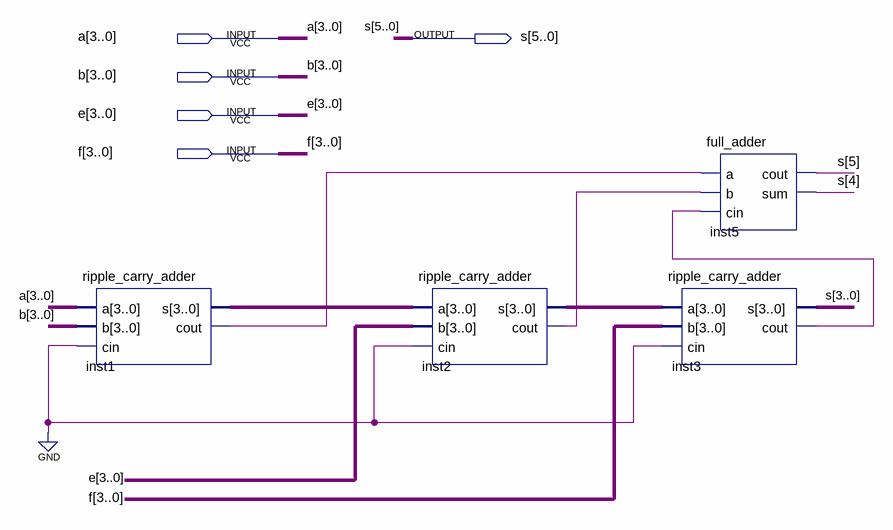
[diagram p0: schematic sheet]
// Quartus schematic ripplecarryadder_4bit_4numbers.bdf as structural Verilog: 4 symbols, 5 pins
module ripplecarryadder_4bit_4numbers (
  input  [3:0] a,
  input  [3:0] b,
  input  [3:0] e,
  input  [3:0] f,
  output [5:0] s
);

  wire inst1_cout, inst2_cout, inst3_cout;
  wire [3:0] inst1_s, inst2_s;

  ripple_carry_adder inst1 (.a(a), .b(b), .cin(1'b0), .s(inst1_s), .cout(inst1_cout));
  ripple_carry_adder inst2 (.a(inst1_s), .b(e), .cin(1'b0), .s(inst2_s), .cout(inst2_cout));
  ripple_carry_adder inst3 (.a(inst2_s), .b(f), .cin(1'b0), .s(s[3:0]), .cout(inst3_cout));
  full_adder inst5 (.a(inst1_cout), .b(inst2_cout), .cin(inst3_cout), .cout(s[5]), .sum(s[4]));
endmodule
